# Altium schematic sheet LMX2820.SchDoc
size B; SheetNumber: 7; SheetTotal: 15
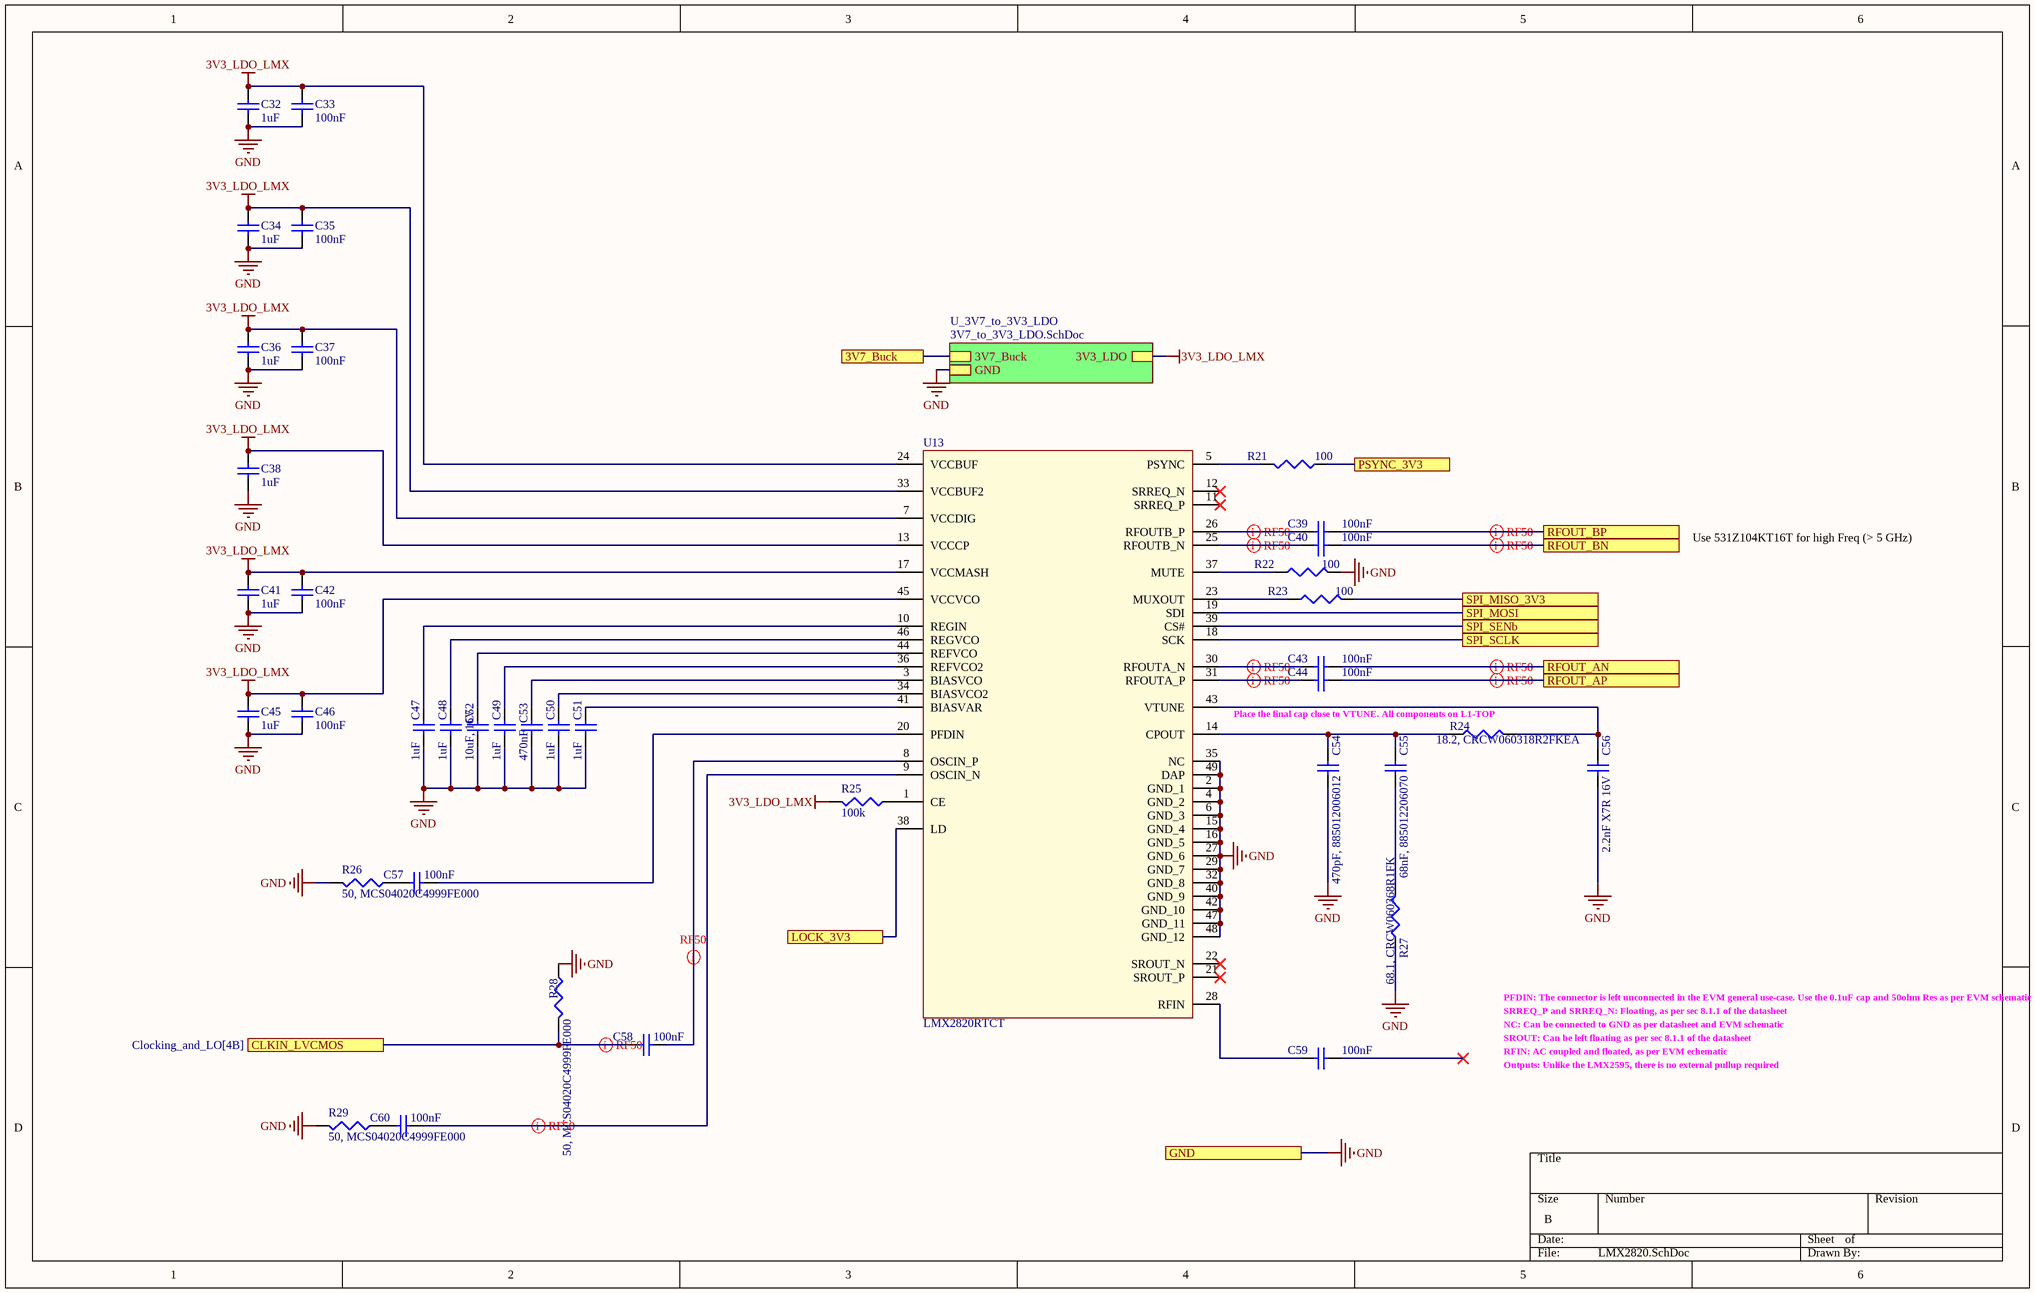
[diagram p0: LMX2820.SchDoc]

## Parts
C32  1uF  [SMD-0402]
C33  100nF  [SMD-0402]
C34  1uF  [SMD-0402]
C35  100nF  [SMD-0402]
C36  1uF  [SMD-0402]
C37  100nF  [SMD-0402]
C38  1uF  [SMD-0402]
C39  100nF  [Johanson-0201]
C40  100nF  [Johanson-0201]
C41  1uF  [SMD-0402]
C42  100nF  [SMD-0402]
C43  100nF  [Johanson-0201]
C44  100nF  [Johanson-0201]
C45  1uF  [SMD-0402]
C46  100nF  [SMD-0402]
C47  1uF  [SMD-0402]
C48  1uF  [SMD-0402]
C49  1uF  [SMD-0402]
C50  1uF  [SMD-0402]
C51  1uF  [SMD-0402]
C52  10uF, 16V  [SMD-0603]
C53  470nF  [SMD-0402]
C54  470pF, 885012006012  [SMD-0603]
C55  68nF, 885012206070  [SMD-0603]
C56  2.2nF X7R 16V  [SMD-0402]
C57  100nF  [SMD-0402]
C58  100nF  [SMD-0402]
C59  100nF  [SMD-0402]
C60  100nF  [SMD-0402]
R21  100  [SMD-0402]
R22  100  [SMD-0402]
R23  100  [SMD-0402]
R24  18.2, CRCW060318R2FKEA  [SMD-0603]
R25  100k  [SMD-0402]
R26  50, MCS04020C4999FE000  [SMD-0402]
R27  68.1, CRCW060368R1FK  [SMD-0603]
R28  50, MCS04020C4999FE000  [SMD-0402]
R29  50, MCS04020C4999FE000  [SMD-0402]
U13  LMX2820RTCT  [TI LMX2820]

## Sub-sheets
U_3V7_to_3V3_LDO = 3V7_to_3V3_LDO.SchDoc: 3V7_Buck, GND, 3V3_LDO

## Ports
3V7_Buck (see Clocking_and_LO[4B], 3V7_to_3V3_LDO[1A], Clocking_and_LO[1B]), CLKIN_LVCMOS (see Clocking_and_LO[4B]), GND (see Clocking_and_LO[5B], 3V7_to_3V3_LDO[1B], 5V5_to_5V0_LDO[1C], Buck_TPSM82913_1V8[3C], Buck_TPSM82913_3V7[3C], Buck_TPSM82913_5V0[3C], Buck_TPSM82913_5V5[2C], Clocking_and_LO[2A], Fan_Interfaces[2B], IQ_Demod[1C], IQ_Mod[1B], Microzed_Interfaces[1A], Power_Supply[6B], Voltage_Conv_Bidirectional[1B]), LOCK_3V3 (see Clocking_and_LO[5B]), PSYNC_3V3 (see Clocking_and_LO[4B]), RFOUT_AN (see Clocking_and_LO[5B]), RFOUT_AP (see Clocking_and_LO[5B]), RFOUT_BN (see Clocking_and_LO[5B]), RFOUT_BP (see Clocking_and_LO[5B]), SPI_MISO_3V3 (see Clocking_and_LO[4B]), SPI_MOSI (see Clocking_and_LO[4B]), SPI_SCLK (see Clocking_and_LO[4B]), SPI_SENb (see Clocking_and_LO[4B])

## Nets
3V3_LDO_LMX: C32.2 C33.2 C34.2 C35.2 C36.2 C37.2 C38.2 C41.2 C42.2 C45.2 C46.2 R25.2 U13.7(VCCDIG) U13.13(VCCCP) U13.17(VCCMASH) U13.24(VCCBUF) U13.33(VCCBUF2) U13.45(VCCVCO) ; sheet U_3V7_to_3V3_LDO/3V3_LDO
GND: C32.1 C33.1 C34.1 C35.1 C36.1 C37.1 C38.1 C41.1 C42.1 C45.1 C46.1 C47.1 C48.1 C49.1 C50.1 C51.1 C52.1 C53.1 C54.1 C56.1 R22.2 R26.2 R27.1 R28.1 R29.2 U13.2(GND_1) U13.4(GND_2) U13.6(GND_3) U13.15(GND_4) U13.16(GND_5) U13.27(GND_6) U13.29(GND_7) U13.32(GND_8) U13.35(NC) U13.40(GND_9) U13.42(GND_10) U13.47(GND_11) U13.48(GND_12) U13.49(DAP) ; port GND, sheet U_3V7_to_3V3_LDO/GND
3V7_Buck: port 3V7_Buck, sheet U_3V7_to_3V3_LDO/3V7_Buck
CLKIN_LVCMOS: C58.2 R28.2 ; port CLKIN_LVCMOS
LOCK_3V3: U13.38(LD) ; port LOCK_3V3
PSYNC_3V3: R21.1 ; port PSYNC_3V3
RFOUT_AN: C43.2 ; port RFOUT_AN
RFOUT_AP: C44.2 ; port RFOUT_AP
RFOUT_BN: C40.2 ; port RFOUT_BN
RFOUT_BP: C39.2 ; port RFOUT_BP
SPI_MISO_3V3: R23.2 ; port SPI_MISO_3V3
SPI_MOSI: U13.19(SDI) ; port SPI_MOSI
SPI_SCLK: U13.18(SCK) ; port SPI_SCLK
SPI_SENb: U13.39(CS#) ; port SPI_SENb
NetC39_1: C39.1 U13.26(RFOUTB_P)
NetC40_1: C40.1 U13.25(RFOUTB_N)
NetC43_1: C43.1 U13.30(RFOUTA_N)
NetC44_1: C44.1 U13.31(RFOUTA_P)
NetC47_2: C47.2 U13.10(REGIN)
NetC48_2: C48.2 U13.46(REGVCO)
NetC49_2: C49.2 U13.36(REFVCO2)
NetC50_2: C50.2 U13.34(BIASVCO2)
NetC51_2: C51.2 U13.41(BIASVAR)
NetC52_2: C52.2 U13.44(REFVCO)
NetC53_2: C53.2 U13.3(BIASVCO)
NetC54_2: C54.2 C55.2 R24.1 U13.14(CPOUT)
NetC55_1: C55.1 R27.2
NetC56_2: C56.2 R24.2 U13.43(VTUNE)
NetC57_1: C57.1 U13.20(PFDIN)
NetC57_2: C57.2 R26.1
NetC58_1: C58.1 U13.8(OSCIN_P)
NetC59_1: C59.1 U13.28(RFIN)
NetC60_1: C60.1 U13.9(OSCIN_N)
NetC60_2: C60.2 R29.1
NetR21_2: R21.2 U13.5(PSYNC)
NetR22_1: R22.1 U13.37(MUTE)
NetR23_1: R23.1 U13.23(MUXOUT)
NetR25_1: R25.1 U13.1(CE)

Not connected (* = marked no-connect by the designer): C59 2*; U13 11(SRREQ_P)* 12(SRREQ_N)* 21(SROUT_P)* 22(SROUT_N)*

## Layout directives
net class RF50: CLKIN_LVCMOS, NetC39_1, NetC40_1, NetC43_1, NetC44_1, NetC58_1, NetC60_1, RFOUT_AN, RFOUT_AP, RFOUT_BN, RFOUT_BP

## Notes on the sheet
- Use 531Z104KT16T for high Freq (> 5 GHz)
- (near R24) Place the final cap close to VTUNE. All components on L1-TOP
- PFDIN: The connector is left unconnected in the EVM general use-case. Use the 0.1uF cap and 50ohm Res as per EVM schematic
- SRREQ_P and SRREQ_N: Floating, as per sec 8.1.1 of the datasheet
- NC: Can be connected to GND as per datasheet and EVM schematic
- SROUT: Can be left floating as per sec 8.1.1 of the datasheet
- RFIN: AC coupled and floated, as per EVM echematic
- Outputs: Unlike the LMX2595, there is no external pullup required

## Library data of the parts
C32-C38 C41 C42 C45-C51 C53 C56-C60 = CAP0402: Ceramic Capacitor 0402
C39 C40 C43 C44 = CAP0201: Capacitor 0201 Imperial
C52 C54 C55 = CAP0603: Ceramic Capacitor 0603
R21-R23 R25 R26 R28 R29 = RES0402: Resistor-0402
R24 R27 = RES0603: Resistor-0603
U13 = LMX2820RTCT: Phase Locked Loops - PLL 22.6-GHz wideband RF synthesizer with phase synchronization, JESD and <5- us frequency calibration 48-VQFN -40 to 85; Manufacturer_Name: Texas Instruments; Geometry.Height: 0.9mm; Manufacturer_Part_Number: LMX2820RTCT; Mouser Part Number: 595-LMX2820RTCT; Mouser Price/Stock: https://www.mouser.co.uk/ProductDetail/Texas-Instruments/LMX2820RTCT?qs=eP2BKZSCXI4hpj09QD%252Biqg%3D%3D; Arrow Part Number: LMX2820RTCT; Arrow Price/Stock: https://www.arrow.com/en/products/lmx2820rtct/texas-instruments?region=nac; Mouser Testing Part Number: *; Mouser Testing Price/Stock: *; Datasheet Link: https://www.ti.com/lit/ds/symlink/lmx2820.pdf?ts=1616090349546&ref_url=https%253A%252F%252Fwww.ti.com%252Fstore%252Fti%252Fen%252Fp%252Fproduct%252F%253Fp%253DLMX2820RTCT